# Altium project Vesta_cape.PrjPcb
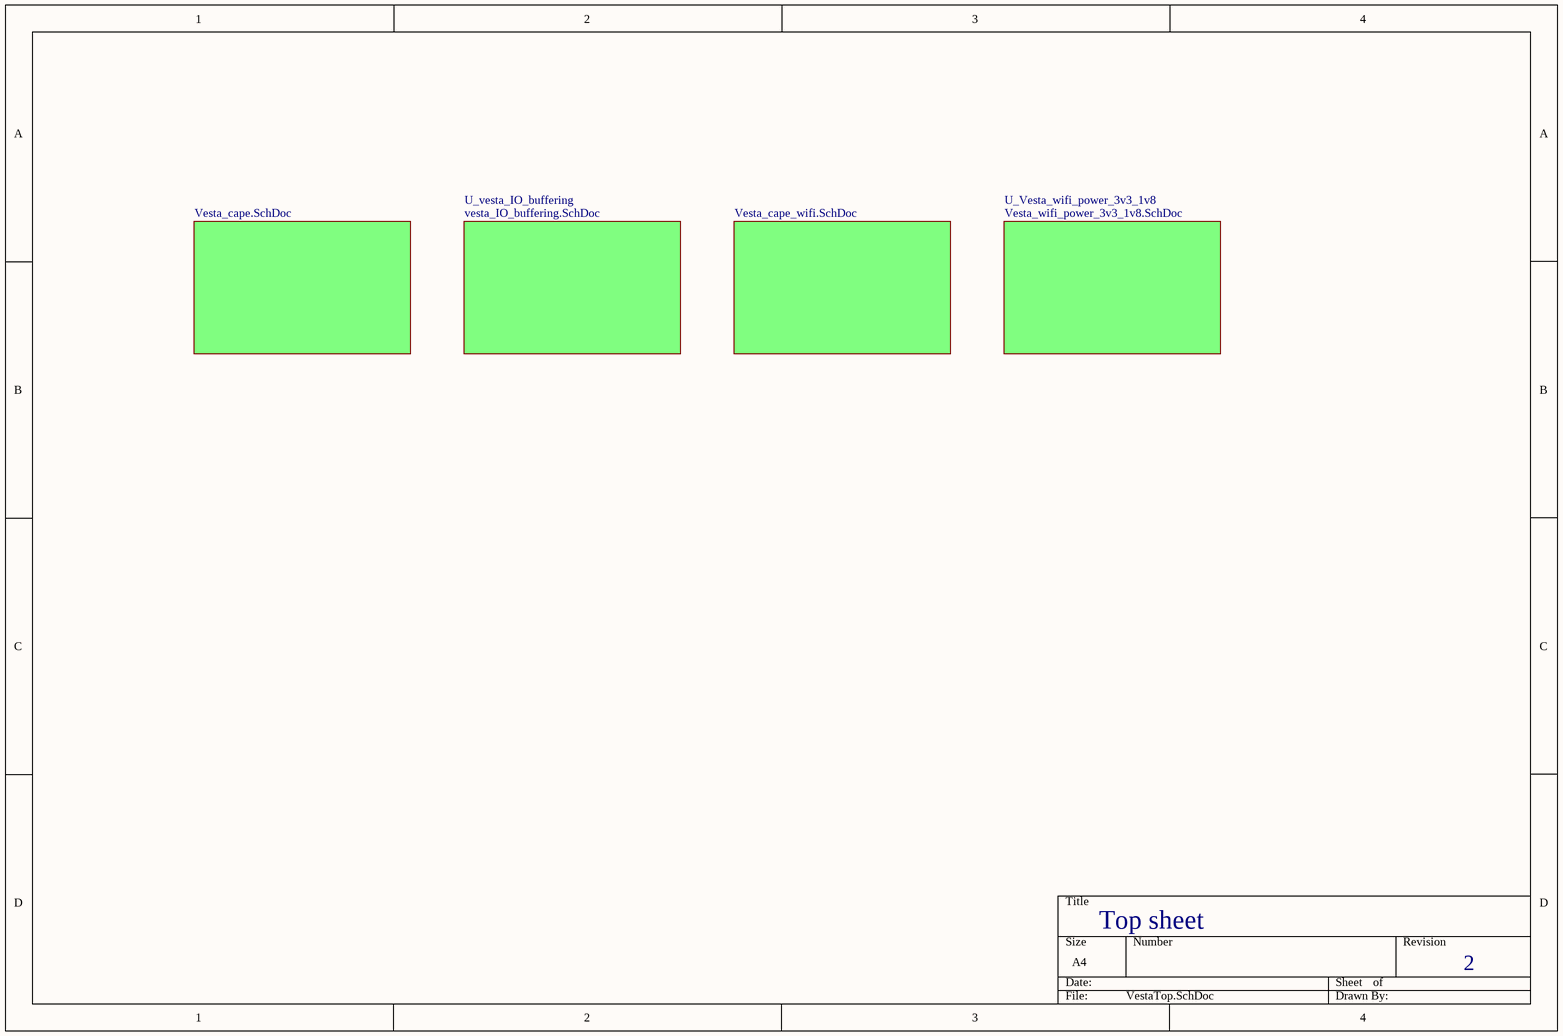
[diagram p0: VestaTop.SchDoc]
5 sheets, 135 parts. Net scope: flat (ports and power ports of the same name join across sheets).
Board file: Vesta_cape.PcbDoc
Sheets:
  VestaTop.SchDoc
    U_Vesta_cape_wifi = Vesta_cape_wifi.SchDoc
    U_Vesta_cape = Vesta_cape.SchDoc
    U_vesta_IO_buffering = vesta_IO_buffering.SchDoc
    U_Vesta_wifi_power_3v3_1v8 = Vesta_wifi_power_3v3_1v8.SchDoc

## Sheet VestaTop.SchDoc
size A4

### Sub-sheets
U_Vesta_cape = Vesta_cape.SchDoc: no entries
U_Vesta_cape_wifi = Vesta_cape_wifi.SchDoc: no entries
U_vesta_IO_buffering = vesta_IO_buffering.SchDoc: no entries
U_Vesta_wifi_power_3v3_1v8 = Vesta_wifi_power_3v3_1v8.SchDoc: no entries

### Notes on the sheet
- Top sheet
- 2

## Sheet Vesta_cape_wifi.SchDoc
size A3
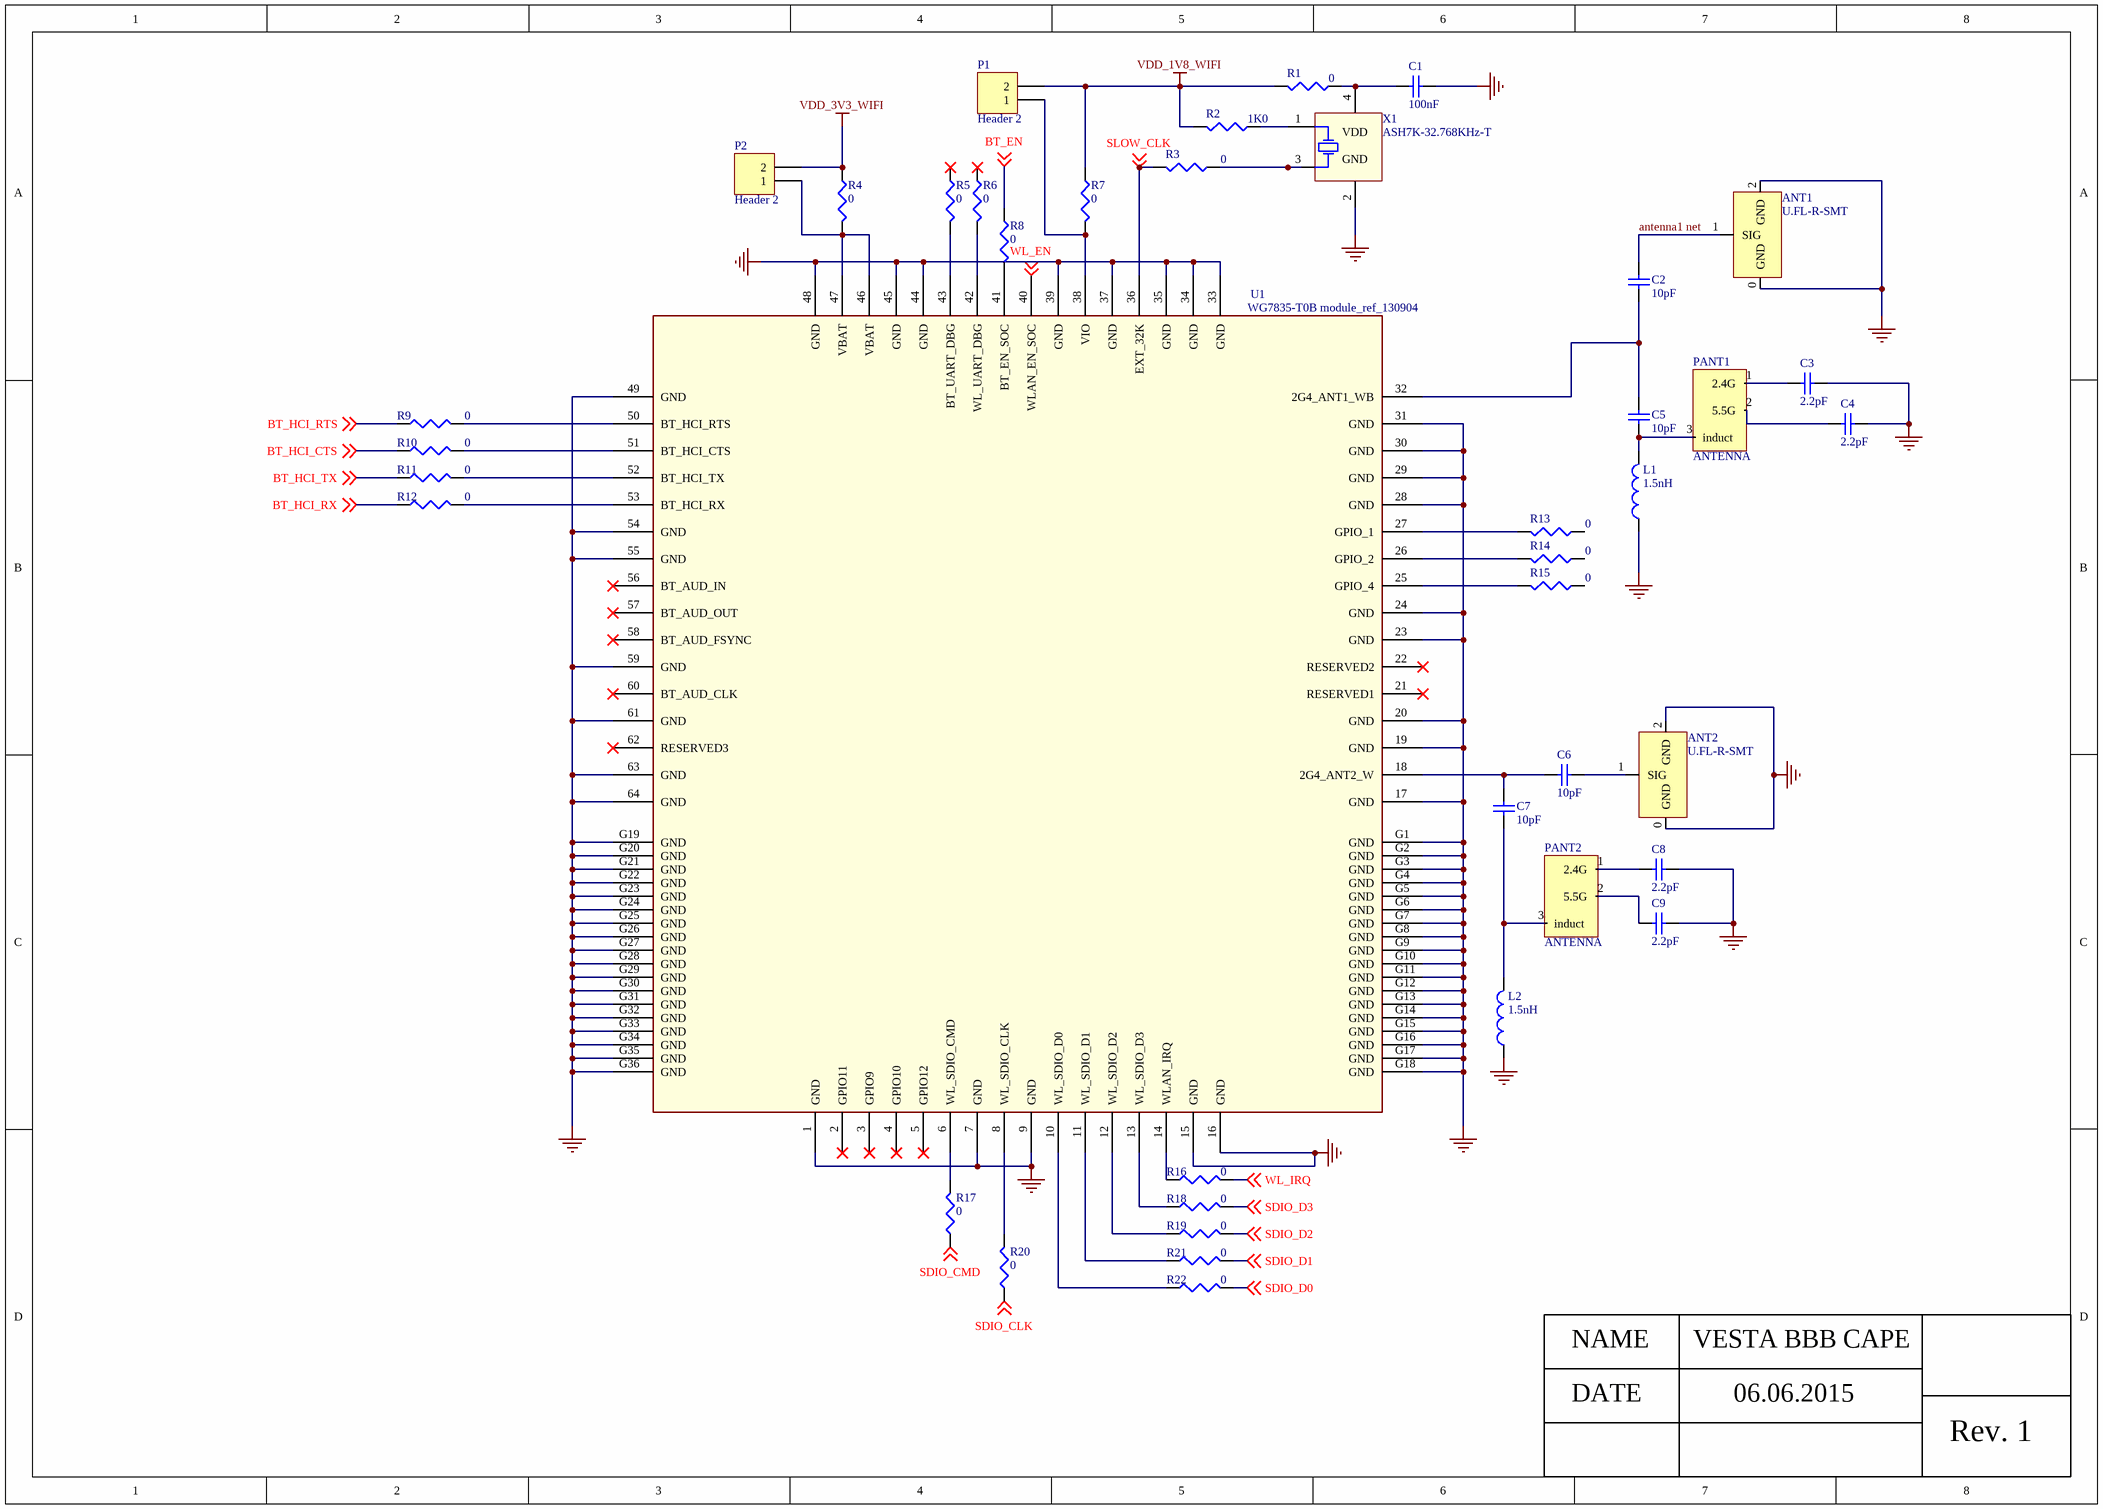
[diagram p1: Vesta_cape_wifi.SchDoc]

### Parts
ANT1  U.FL-R-SMT  [U.FL-R-SMT]
ANT2  U.FL-R-SMT  [U.FL-R-SMT]
C1  100nF  [C1206]
C2  10pF  [Capacitor_0603]
C3  2.2pF  [Capacitor_0603]
C4  2.2pF  [Capacitor_0603]
C5  10pF  [Capacitor_0603]
C6  10pF  [Capacitor_0603]
C7  10pF  [Capacitor_0603]
C8  2.2pF  [Capacitor_0603]
C9  2.2pF  [Capacitor_0603]
L1  1.5nH  [0402-A]
L2  1.5nH  [0402-A]
P1  Header 2  [HDR1X2]
P2  Header 2  [HDR1X2]
PANT1  ANTENNA  [ANT_BRD_CUT]
PANT2  ANTENNA  [ANT_BRD_CUT]
R1  0  [J1-0603]
R2  1K0  [J1-0603]
R3  0  [J1-0603]
R4  0  [J1-0603]
R5  0  [J1-0603]
R6  0  [J1-0603]
R7  0  [J1-0603]
R8  0  [J1-0603]
R9  0  [J1-0603]
R10  0  [J1-0603]
R11  0  [J1-0603]
R12  0  [J1-0603]
R13  0  [J1-0603]
R14  0  [J1-0603]
R15  0  [J1-0603]
R16  0  [J1-0603]
R17  0  [J1-0603]
R18  0  [J1-0603]
R19  0  [J1-0603]
R20  0  [J1-0603]
R21  0  [J1-0603]
R22  0  [J1-0603]
U1  WG7835-T0B module_ref_130904  [E-13.4X13.3-N100_0.75-TOP]
X1  ASH7K-32.768KHz-T  [ABRA-ASH7K-4_V]

### Nets
GND: ANT1.0(GND) ANT1.2(GND) ANT2.0(GND) ANT2.2(GND) C1.1 C3.2 C4.2 C8.2 C9.2 L1.1 L2.1 U1.1(GND) U1.7(GND) U1.9(GND) U1.15(GND) U1.16(GND) U1.17(GND) U1.19(GND) U1.20(GND) U1.23(GND) U1.24(GND) U1.28(GND) U1.29(GND) U1.30(GND) U1.31(GND) U1.33(GND) U1.34(GND) U1.35(GND) U1.37(GND) U1.39(GND) U1.44(GND) U1.45(GND) U1.48(GND) U1.49(GND) U1.54(GND) U1.55(GND) U1.59(GND) U1.61(GND) U1.63(GND) U1.64(GND) U1.G1(GND) U1.G2(GND) U1.G3(GND) U1.G4(GND) U1.G5(GND) U1.G6(GND) U1.G7(GND) U1.G8(GND) U1.G9(GND) U1.G10(GND) U1.G11(GND) U1.G12(GND) U1.G13(GND) U1.G14(GND) U1.G15(GND) U1.G16(GND) U1.G17(GND) U1.G18(GND) U1.G19(GND) U1.G20(GND) U1.G21(GND) U1.G22(GND) U1.G23(GND) U1.G24(GND) U1.G25(GND) U1.G26(GND) U1.G27(GND) U1.G28(GND) U1.G29(GND) U1.G30(GND) U1.G31(GND) U1.G32(GND) U1.G33(GND) U1.G34(GND) U1.G35(GND) U1.G36(GND) X1.2(GND)
VDD_1V8_WIFI: P1.2 R1.2 R2.2 R7.1
VDD_3V3_WIFI: P2.2 R4.1
antenna1 net: ANT1.1(SIG) C2.2
BT_EN: R8.1 ; off-sheet BT_EN
BT_HCI_CTS: R10.1 ; off-sheet BT_HCI_CTS
BT_HCI_RTS: R9.1 ; off-sheet BT_HCI_RTS
BT_HCI_RX: R12.1 ; off-sheet BT_HCI_RX
BT_HCI_TX: R11.1 ; off-sheet BT_HCI_TX
SDIO_CLK: R20.1 ; off-sheet SDIO_CLK
SDIO_CMD: R17.1 ; off-sheet SDIO_CMD
SDIO_D0: R22.2 ; off-sheet SDIO_D0
SDIO_D1: R21.2 ; off-sheet SDIO_D1
SDIO_D2: R19.2 ; off-sheet SDIO_D2
SDIO_D3: R18.2 ; off-sheet SDIO_D3
SLOW_CLK: R3.2 U1.36(EXT_32K) ; off-sheet SLOW_CLK
WL_EN: U1.40(WLAN_EN_SOC) ; off-sheet WL_EN
WL_IRQ: R16.2 ; off-sheet WL_IRQ
NetANT2_1: ANT2.1(SIG) C6.2
NetC1_2: C1.2 R1.1 X1.4(VDD)
NetC2_1: C2.1 C5.2 U1.32(2G4_ANT1_WB)
NetC3_1: C3.1 PANT1.1(2.4G)
NetC4_1: C4.1 PANT1.2(5.5G)
NetC5_1: C5.1 L1.2 PANT1.3(induct)
NetC6_1: C6.1 C7.2 U1.18(2G4_ANT2_W)
NetC7_1: C7.1 L2.2 PANT2.3(induct)
NetC8_1: C8.1 PANT2.1(2.4G)
NetC9_1: C9.1 PANT2.2(5.5G)
NetP1_1: P1.1 R7.2 U1.38(VIO)
NetP2_1: P2.1 R4.2 U1.46(VBAT) U1.47(VBAT)
NetR2_1: R2.1 X1.1(VIO)
NetR3_1: R3.1 X1.3(Output)
NetR5_2: R5.2 U1.43(BT_UART_DBG)
NetR6_2: R6.2 U1.42(WL_UART_DBG)
NetR8_2: R8.2 U1.41(BT_EN_SOC)
NetR9_2: R9.2 U1.50(BT_HCI_RTS)
NetR10_2: R10.2 U1.51(BT_HCI_CTS)
NetR11_2: R11.2 U1.52(BT_HCI_TX)
NetR12_2: R12.2 U1.53(BT_HCI_RX)
NetR13_2: R13.2 U1.27(GPIO_1)
NetR14_2: R14.2 U1.26(GPIO_2)
NetR15_2: R15.2 U1.25(GPIO_4)
NetR16_1: R16.1 U1.14(WLAN_IRQ)
NetR17_2: R17.2 U1.6(WL_SDIO_CMD)
NetR18_1: R18.1 U1.13(WL_SDIO_D3)
NetR19_1: R19.1 U1.12(WL_SDIO_D2)
NetR20_2: R20.2 U1.8(WL_SDIO_CLK)
NetR21_1: R21.1 U1.11(WL_SDIO_D1)
NetR22_1: R22.1 U1.10(WL_SDIO_D0)

Not connected (* = marked no-connect by the designer): R5 1*; R6 1*; R13 1; R14 1; R15 1; U1 2(GPIO11)* 3(GPIO9)* 4(GPIO10)* 5(GPIO12)* 21(RESERVED1)* 22(RESERVED2)* 56(BT_AUD_IN)* 57(BT_AUD_OUT)* 58(BT_AUD_FSYNC)* 60(BT_AUD_CLK)* 62(RESERVED3)*

### Notes on the sheet
- NAME
- VESTA BBB CAPE
- DATE
- 06.06.2015
- Rev. 1

### Library data of the parts
ANT1 ANT2 = U.FL-R-SMT: pin to pad: 0>2
C1 C2 C4-C7 C9 = Cap Semi: Capacitor (Semiconductor SIM Model); Published: 8-Jun-2000; LatestRevisionDate: 29-May-2009; LatestRevisionNote: IPC-7351 Footprint Added.; PackageReference: C1206; Publisher: Altium Limited; PackageDescription: Chip Capacitor
  C1: Value: 100nF
  C2 C5-C7: Value: 10pF
  C4 C9: Value: 2.2pF
C3 C8 = Cap Semi: Capacitor (Semiconductor SIM Model); Value: 100pF; Published: 8-Jun-2000; LatestRevisionDate: 29-May-2009; LatestRevisionNote: IPC-7351 Footprint Added.; PackageReference: C1206; Publisher: Altium Limited; PackageDescription: Chip Capacitor
L1 L2 = Inductor: Code_IEC: 1005; Value: 1.5nHH; Published: 8-Jun-2000; LatestRevisionDate: 29-May-2009; LatestRevisionNote: IPC-7351 Footprint Added.; PackageReference: 0402-A; Publisher: Altium Limited; PackageDescription: Chip Inductor; Code_JEITA: 0402
P1 P2 = Header 2: Header, 2-Pin; LatestRevisionDate: 17-Jul-2002; LatestRevisionNote: Re-released for DXP Platform.; Publisher: Altium Limited
R1-R22 = Res3: Resistor; Value: 1K; Published: 8-Jun-2000; LatestRevisionDate: 29-May-2009; LatestRevisionNote: IPC-7351 Footprint Added.; PackageReference: J1-0603; Publisher: Altium Limited; PackageDescription: Chip Resistor
X1 = CMP-0448-00001-2: Crystal Oscillator, 32.768 kHz, -40 to 80 degC, 3.2 x 1.5 x 1.0 mm SMD, Tape and Reel; Manufacturer: Abracon; Start-up Time (Max): 0.6 s; Vdd Current Consumption (Max): 0.7 uA; Fall Time (Max): 50 ns; Disable Delay Time (Max): 1 us; Supply Voltage Range (VIO): 1.5 to 36 V; Output Load (CMOS): 15 pF; VIO Current Consumption (Max): 3.5 uA; Frequency Tolerance: -18 to 28 ppm; ComponentLink3URL: http://www.abracon.com/Oscillators/ASH7K.pdf; PackageReference: ASH7K-4; ComponentLink1Description: Manufacturer URL; Mounting Technology: Surface Mount; PackageDescription: 4-Pin Hand Drawn, Body 3.2x1.5mm; ComponentLink2URL: http://www.abracon.com/Oscillators/ASH7K.pdf; ComponentLink2Description: Datasheet; PartNumber: ASH7K-32.768KHz-T; ComponentLink1URL: http://www.abracon.com/; Rise Time(Max): 50 ns; DatasheetVersion: 12.27.11; Packing: Tape and Reel; ComponentLink3Description: Package Specification; Supply Voltage Range (Vdd): 1.5 to 36 V; Frequency: 32.768 kHz; Operating Temperature: -40 to 85 degC

## Sheet Vesta_cape.SchDoc: Vesta cape 1
size A3
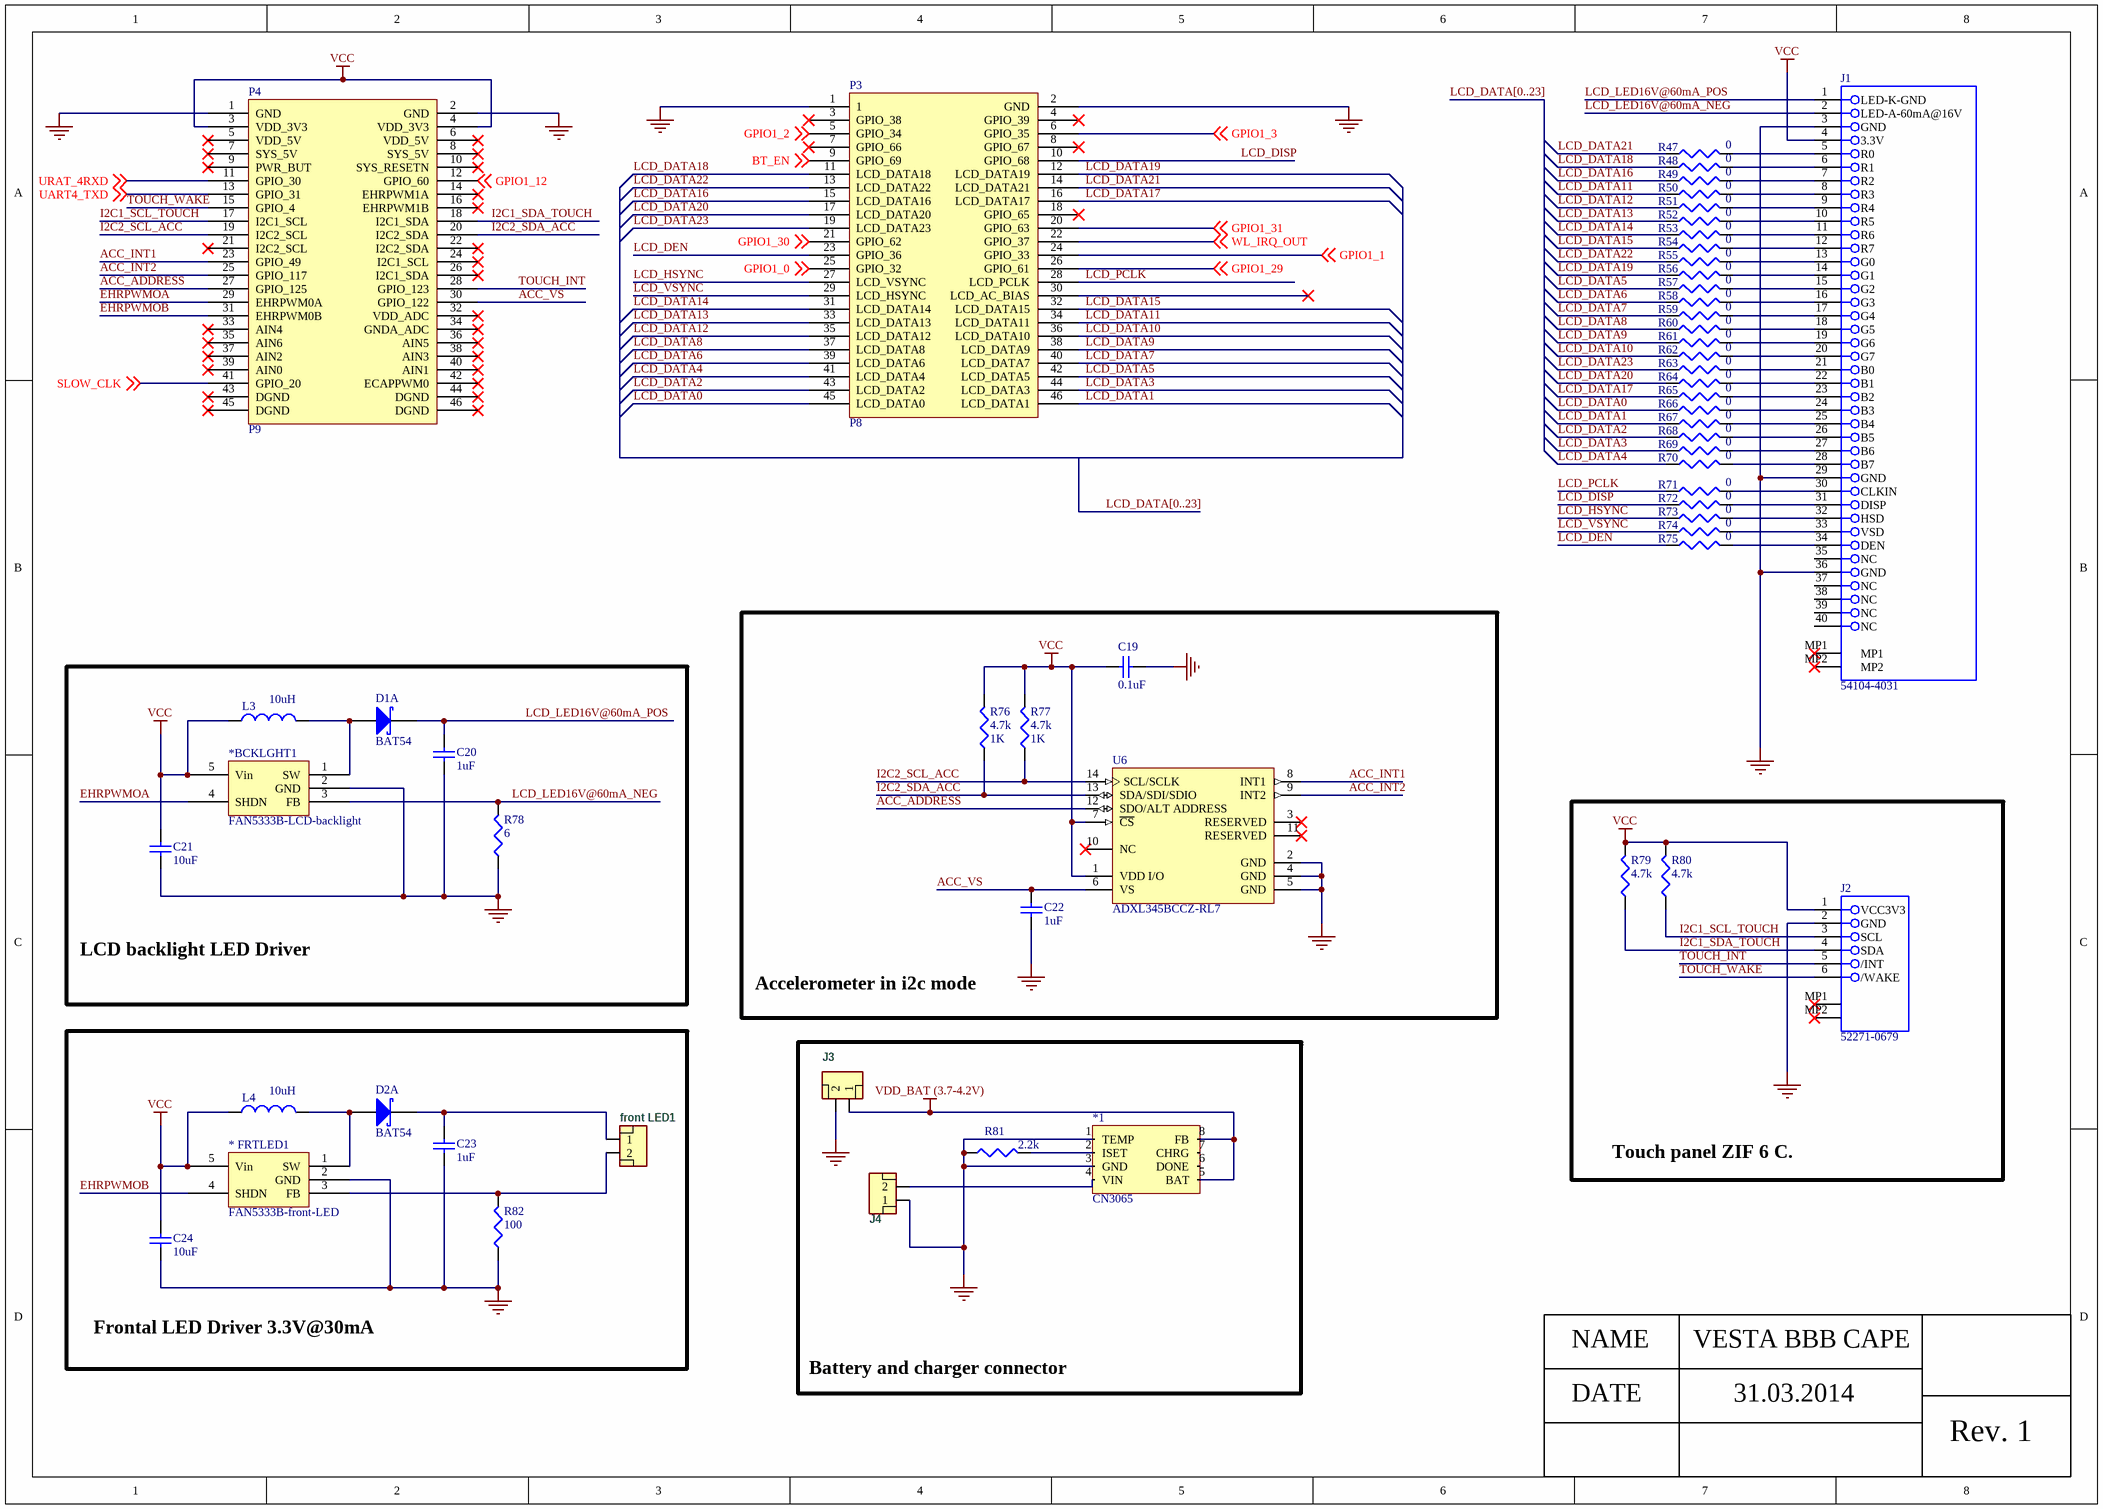
[diagram p2: Vesta_cape.SchDoc]

### Parts
*1  CN3065  [CN3065-LIPO]
*_FRTLED1  FAN5333B-front-LED  [FAN5333A]
*BCKLGHT1  FAN5333B-LCD-backlight  [FAN5333A]
C19  0.1uF  [C1206]
C20  1uF  [C1206]
C21  10uF  [C1206]
C22  1uF  [C1206]
C23  1uF  [C1206]
C24  10uF  [C1206]
D1  BAT54  [NXP-SOT23-3_V]  (part A of 2)
D2  BAT54  [NXP-SOT23-3_V]  (part A of 2)
front_LED1  (no value)  [JMP1X2-F180_2.54]
J1  54104-4031  [MOLX-54104-4031]
J2  52271-0679  [MOLX-52271-0679]
J3  (no value)  [JMP1X2-F180_2.54]
J4  (no value)  [JMP1X2-F180_2.54]
L3  10uH  [0402-A]
L4  10uH  [0402-A]
P3  P8  [HEADER_23_2_SMD]
P4  P9  [HEADER_23_2_SMD]
R47  0  [J1-0603]
R48  0  [J1-0603]
R49  0  [J1-0603]
R50  0  [J1-0603]
R51  0  [J1-0603]
R52  0  [J1-0603]
R53  0  [J1-0603]
R54  0  [J1-0603]
R55  0  [J1-0603]
R56  0  [J1-0603]
R57  0  [J1-0603]
R58  0  [J1-0603]
R59  0  [J1-0603]
R60  0  [J1-0603]
R61  0  [J1-0603]
R62  0  [J1-0603]
R63  0  [J1-0603]
R64  0  [J1-0603]
R65  0  [J1-0603]
R66  0  [J1-0603]
R67  0  [J1-0603]
R68  0  [J1-0603]
R69  0  [J1-0603]
R70  0  [J1-0603]
R71  0  [J1-0603]
R72  0  [J1-0603]
R73  0  [J1-0603]
R74  0  [J1-0603]
R75  0  [J1-0603]
R76  4.7k  value 1K  [J1-0603]
R77  4.7k  value 1K  [J1-0603]
R78  6  [J1-0603]
R79  4.7k  [J1-0603]
R80  4.7k  [J1-0603]
R81  2.2k  [J1-0603]
R82  100  [J1-0603]
U6  ADXL345BCCZ-RL7  [ADI-CC-14-1_V]

### Nets
GND: *1.1(TEMP) *1.3(GND) *_FRTLED1.2(GND) *BCKLGHT1.2(GND) C19.1 C20.1 C21.1 C22.1 C23.1 C24.1 J1.3(GND) J1.29(GND) J1.36(GND) J2.2(GND) J3.2 J4.1 P3.1 P3.2(GND) P4.1(GND) P4.2(GND) R78.1 R81.1 R82.1 U6.2(GND) U6.4(GND) U6.5(GND)
VCC: *_FRTLED1.5(Vin) *BCKLGHT1.5(Vin) C19.2 C21.2 C24.2 J1.4(3.3V) J2.1(VCC3V3) L3.1 L4.1 P4.3(VDD_3V3) P4.4(VDD_3V3) R76.2 R77.2 R79.2 R80.2 U6.1(VDD_I/O) U6.7(~{CS})
VDD_BAT (3.7-4.2V): *1.5(BAT) *1.8(FB) J3.1
ACC_ADDRESS: P4.27(GPIO_125) U6.12(SDO/ALT_ADDRESS)
ACC_INT1: P4.23(GPIO_49) U6.8(INT1)
ACC_INT2: P4.25(GPIO_117) U6.9(INT2)
ACC_VS: C22.2 P4.30(GPIO_122) U6.6(VS)
BT_EN: P3.9(GPIO_69) ; off-sheet BT_EN
EHRPWMOA: *BCKLGHT1.4(SHDN) P4.29(EHRPWM0A)
EHRPWMOB: *_FRTLED1.4(SHDN) P4.31(EHRPWM0B)
GPIO1_0: P3.25(GPIO_32) ; off-sheet GPIO1_0
GPIO1_1: P3.24(GPIO_33) ; off-sheet GPIO1_1
GPIO1_2: P3.5(GPIO_34) ; off-sheet GPIO1_2
GPIO1_3: P3.6(GPIO_35) ; off-sheet GPIO1_3
GPIO1_12: P4.12(GPIO_60) ; off-sheet GPIO1_12
GPIO1_29: P3.26(GPIO_61) ; off-sheet GPIO1_29
GPIO1_30: P3.21(GPIO_62) ; off-sheet GPIO1_30
GPIO1_31: P3.20(GPIO_63) ; off-sheet GPIO1_31
I2C1_SCL_TOUCH: J2.3(SCL) P4.17(I2C1_SCL) R80.1
I2C1_SDA_TOUCH: J2.4(SDA) P4.18(I2C1_SDA) R79.1
I2C2_SCL_ACC: P4.19(I2C2_SCL) R77.1 U6.14(SCL/SCLK)
I2C2_SDA_ACC: P4.20(I2C2_SDA) R76.1 U6.13(SDA/SDI/SDIO)
LCD_DATA0: P3.45(LCD_DATA0) R66.1
LCD_DATA1: P3.46(LCD_DATA1) R67.1
LCD_DATA2: P3.43(LCD_DATA2) R68.1
LCD_DATA3: P3.44(LCD_DATA3) R69.1
LCD_DATA4: P3.41(LCD_DATA4) R70.1
LCD_DATA5: P3.42(LCD_DATA5) R57.1
LCD_DATA6: P3.39(LCD_DATA6) R58.1
LCD_DATA7: P3.40(LCD_DATA7) R59.1
LCD_DATA8: P3.37(LCD_DATA8) R60.1
LCD_DATA9: P3.38(LCD_DATA9) R61.1
LCD_DATA10: P3.36(LCD_DATA10) R62.1
LCD_DATA11: P3.34(LCD_DATA11) R50.1
LCD_DATA12: P3.35(LCD_DATA12) R51.1
LCD_DATA13: P3.33(LCD_DATA13) R52.1
LCD_DATA14: P3.31(LCD_DATA14) R53.1
LCD_DATA15: P3.32(LCD_DATA15) R54.1
LCD_DATA16: P3.15(LCD_DATA16) R49.1
LCD_DATA17: P3.16(LCD_DATA17) R65.1
LCD_DATA18: P3.11(LCD_DATA18) R48.1
LCD_DATA19: P3.12(LCD_DATA19) R56.1
LCD_DATA20: P3.17(LCD_DATA20) R64.1
LCD_DATA21: P3.14(LCD_DATA21) R47.1
LCD_DATA22: P3.13(LCD_DATA22) R55.1
LCD_DATA23: P3.19(LCD_DATA23) R63.1
LCD_DEN: P3.23(GPIO_36) R75.1
LCD_DISP: P3.10(GPIO_68) R72.1
LCD_HSYNC: P3.27(LCD_VSYNC) R73.1
LCD_LED16V@60mA_NEG: *BCKLGHT1.3(FB) J1.2(LED-A-60mA@16V) R78.2
LCD_LED16V@60mA_POS: C20.2 D1.3(K) J1.1(LED-K-GND)
LCD_PCLK: P3.28(LCD_PCLK) R71.1
LCD_VSYNC: P3.29(LCD_HSYNC) R74.1
SLOW_CLK: P4.41(GPIO_20) ; off-sheet SLOW_CLK
TOUCH_INT: J2.5(/INT) P4.28(GPIO_123)
TOUCH_WAKE: J2.6(/WAKE) P4.15(GPIO_4)
UART4_TXD: P4.13(GPIO_31) ; off-sheet UART4_TXD
URAT_4RXD: P4.11(GPIO_30) ; off-sheet URAT_4RXD
WL_IRQ_OUT: P3.22(GPIO_37) ; off-sheet WL_IRQ_OUT
Net*1_2: *1.2(ISET) R81.2
Net*1_4: *1.4(VIN) J4.2
Net*_FRTLED1_1: *_FRTLED1.1(SW) D2.1(A) L4.2
Net*_FRTLED1_3: *_FRTLED1.3(FB) front_LED1.2 R82.2
Net*BCKLGHT1_1: *BCKLGHT1.1(SW) D1.1(A) L3.2
NetC23_2: C23.2 D2.3(K) front_LED1.1
NetJ1_5: J1.5(R0) R47.2
NetJ1_6: J1.6(R1) R48.2
NetJ1_7: J1.7(R2) R49.2
NetJ1_8: J1.8(R3) R50.2
NetJ1_9: J1.9(R4) R51.2
NetJ1_10: J1.10(R5) R52.2
NetJ1_11: J1.11(R6) R53.2
NetJ1_12: J1.12(R7) R54.2
NetJ1_13: J1.13(G0) R55.2
NetJ1_14: J1.14(G1) R56.2
NetJ1_15: J1.15(G2) R57.2
NetJ1_16: J1.16(G3) R58.2
NetJ1_17: J1.17(G4) R59.2
NetJ1_18: J1.18(G5) R60.2
NetJ1_19: J1.19(G6) R61.2
NetJ1_20: J1.20(G7) R62.2
NetJ1_21: J1.21(B0) R63.2
NetJ1_22: J1.22(B1) R64.2
NetJ1_23: J1.23(B2) R65.2
NetJ1_24: J1.24(B3) R66.2
NetJ1_25: J1.25(B4) R67.2
NetJ1_26: J1.26(B5) R68.2
NetJ1_27: J1.27(B6) R69.2
NetJ1_28: J1.28(B7) R70.2
NetJ1_30: J1.30(CLKIN) R71.2
NetJ1_31: J1.31(DISP) R72.2
NetJ1_32: J1.32(HSD) R73.2
NetJ1_33: J1.33(VSD) R74.2
NetJ1_34: J1.34(DEN) R75.2

Not connected (* = marked no-connect by the designer): *1 6(DONE) 7(CHRG); J1 35(NC) 37(NC) 38(NC) 39(NC) 40(NC) MP1* MP2*; J2 MP1* MP2*; P3 3(GPIO_38)* 4(GPIO_39)* 7(GPIO_66)* 8(GPIO_67)* 18(GPIO_65)* 30(LCD_AC_BIAS)*; P4 5(VDD_5V)* 6(VDD_5V)* 7(SYS_5V)* 8(SYS_5V)* 9(PWR_BUT)* 10(SYS_RESETN)* 14(EHRPWM1A)* 16(EHRPWM1B)* 21(I2C2_SCL)* 22(I2C2_SDA)* 24(I2C1_SCL)* 26(I2C1_SDA)* 32(VDD_ADC)* 33(AIN4)* 34(GNDA_ADC)* 35(AIN6)* 36(AIN5)* 37(AIN2)* 38(AIN3)* 39(AIN0)* 40(AIN1)* 42(ECAPPWM0)* 43(DGND)* 44(DGND)* 45(DGND)* 46(DGND)*; U6 3(RESERVED)* 10(NC)* 11(RESERVED)*

### Buses and harness runs
bus LCD_DATA[0..23]

### Notes on the sheet
- LCD backlight LED Driver 16V@60mA
- Accelerometer in i2c mode
- Touch panel ZIF 6 C.
- Frontal LED Driver 3.3V@30mA
- Battery and charger connector
- NAME
- VESTA BBB CAPE
- DATE
- 31.03.2014
- Rev. 1

### Library data of the parts
*_FRTLED1 *BCKLGHT1 = FAN5333B
C19 = Cap Semi: as C3 on sheet Vesta_cape_wifi; Published: 8-Jun-2000; LatestRevisionDate: 29-May-2009; LatestRevisionNote: IPC-7351 Footprint Added.; PackageReference: C1206; Publisher: Altium Limited; PackageDescription: Chip Capacitor
C20 C22 C23 = Cap Semi: Capacitor (Semiconductor SIM Model); Published: 8-Jun-2000; LatestRevisionDate: 29-May-2009; LatestRevisionNote: IPC-7351 Footprint Added.; PackageReference: C1206; Publisher: Altium Limited; PackageDescription: Chip Capacitor; Value: 1uF
C21 C24 = Cap Semi: Capacitor (Semiconductor SIM Model); Value: 100uF; Published: 8-Jun-2000; LatestRevisionDate: 29-May-2009; LatestRevisionNote: IPC-7351 Footprint Added.; PackageReference: C1206; Publisher: Altium Limited; PackageDescription: Chip Capacitor
D1 D2 = CMP-0417-00004-1: Schottky Barrier Diode, 30 V, 2 uA, -55 to 150 degC, 3-Pin SOT23, RoHS, Tape and Reel; Manufacturer: NXP Semiconductors; Cd (pF): 10; Rth(j-a) (K/W): 500; VF (mV): 800; Trr (ns): 5; IR (uA): 2; VR (V): 30; Mounting Technology: Surface Mount; Temperature Range: -55 to 150 degC; Packing: Tape and Reel; PartNumber: BAT54; ComponentLink2Description: Datasheet; PackageReference: SOT23-3; ComponentLink2URL: http://www.nxp.com/documents/data_sheet/BAT54_SER.pdf; RoHS: TRUE; ComponentLink1Description: Manufacturer URL; PackageDescription: 3-Pin Plastic Surface-mounted Package, Body 1.3 x 2.9 mm, Pitch 0.95 mm; ComponentLink1URL: http://www.nxp.com/; PartId: 1
  D2: DatasheetVersion: Rev. 5
front_LED1 = JST-2: =Description
J1 = MOLX-54104-4031: 0.5 mm Pitch Easy-On(TM) Type FPC Connector, 2.0 mm Mated Height, Right Angle, ZIF, SMT, Top Contact, 40 Circuits, -20 to 85 degC, ELV and RoHS Compliant, Tape and Reel; pin to pad: 1>40 2>39 3>38 4>37 5>36 6>35 7>34 8>33 9>32 10>31 11>30 12>29 13>28 14>27 15>26 16>25 17>24 18>23 19>22 20>21 21>20 22>19 23>18 24>17 25>16 26>15 27>14 28>13 29>12 30>11 31>10 32>9 33>8 34>7 35>6 36>5 37>4 38>3 39>2 40>1; Manufacturer: Molex; PCB Retention: Yes; Current (Max per Contact): 0.5A; Stackable: No; Durability (mating cycles max): 20; Pitch - Mating Interface: 0.50mm; Circuits (Loaded): 40; Mated Height: 2.00mm; Entry Angle: 90degrees Angle; Material - Metal: Phosphor Bronze; Voltage (Max): 50V; ComponentLink3URL: http://www.molex.com/pdm_docs/sd/541044031_sd.pdf; ComponentLink2URL: http://www.molex.com/webdocs/datasheets/pdf/en-us/0541044031_FFC_FPC_CONNECTORS.pdf; Number of Rows: 1; ComponentLink1Description: Manufacturer URL; ComponentLink2Description: Datasheet; Mounting Technology: Surface Mount; ComponentLink1URL: http://www.molex.com/molex/index.jsp; RoHS: TRUE; PackageReference: 54104-4031; Polarized to PCB: Yes; ComponentLink3Description: Package Specification; PackageVersion: Rev. F, 06/2012; PackageDescription: 40-Lead FPC Connector, Pitch 0.5 mm; Contact Position: Top; PCB Locator: No; PartNumber: 54104-4031; Orientation: Right Angle; Packing: Tape and Reel
J2 = MOLX-52271-0679: 1.0 mm Pitch Easy-On(TM) Type FPC Connector, 3.0 mm Mated Height, Right Angle, ZIF, SMT, Bottom Contact, 6 Circuits, -40 to 85 degC, ELV and RoHS Compliant, Tape and Reel; Manufacturer: Molex; Material - Plating Termination: Tin-Bismuth; Pitch - Mating Interface: 1.00mm; Voltage (Max): 50V AC (RMS)/DC; Durability (mating cycles max): 30; Mated Height: 3.00mm; PCB Locator: No; Polarized to PCB: Yes; Material - Metal: Phosphor Bronze; Current (Max per Contact): 0.5A; Circuits (Loaded): 6; Entry Angle: 90degrees Angle; ComponentLink1Description: Manufacturer URL; PackageVersion: Rev. B, 04/2004; PackageDescription: 6-Lead FPC Connector, Pitch 1.0 mm; Packing: Tape and Reel; Contact Position: Bottom; Material - Plating Mating: Tin-Bismuth; PackageReference: 52271-0679; RoHS: TRUE; ComponentLink2Description: Datasheet; ComponentLink1URL: http://www.molex.com/molex/index.jsp; PartNumber: 52271-0679; Pitch - Termination Interface: 1.00mm; ComponentLink3URL: http://www.molex.com/pdm_docs/sd/522710679_sd.pdf; Orientation: Right Angle; Number of Rows: 1; Stackable: No; PCB Retention: Yes; Mounting Technology: Surface Mount; ComponentLink3Description: Package Specification; ComponentLink2URL: http://www.molex.com/webdocs/datasheets/pdf/en-us/0522710679_FFC_FPC_CONNECTORS.pdf
J3 = JST-2: jst2mm connector
J4 = JST-2: jst 2mm connector
L3 L4 = Inductor: Code_IEC: 1005; Value: 10mH; Published: 8-Jun-2000; LatestRevisionDate: 29-May-2009; LatestRevisionNote: IPC-7351 Footprint Added.; PackageReference: 0402-A; Publisher: Altium Limited; PackageDescription: Chip Inductor; Code_JEITA: 0402
P3 = HDR_2_23_M_P8: BBB-P8
P4 = HDR2-23-M-P9: BBB-P9
R47-R75 = Res3: Resistor; Value: 0K; Published: 8-Jun-2000; LatestRevisionDate: 29-May-2009; LatestRevisionNote: IPC-7351 Footprint Added.; PackageReference: J1-0603; Publisher: Altium Limited; PackageDescription: Chip Resistor
R76 R77 R79 R80 R82 = Res3: Resistor; Published: 8-Jun-2000; LatestRevisionDate: 29-May-2009; LatestRevisionNote: IPC-7351 Footprint Added.; PackageReference: J1-0603; Publisher: Altium Limited; PackageDescription: Chip Resistor
  R79 R80: Value: 4.7k
  R82: Value: 100
R78 = Res3: Resistor; Value: 1K; Published: 8-Jun-2000; LatestRevisionDate: 29-May-2009; LatestRevisionNote: IPC-7351 Footprint Added.; PackageReference: J1-0603; Publisher: Altium Limited; PackageDescription: Chip Resistor
R81 = Res3: Resistor; Value: 2K; Published: 8-Jun-2000; LatestRevisionDate: 29-May-2009; LatestRevisionNote: IPC-7351 Footprint Added.; PackageReference: J1-0603; Publisher: Altium Limited; PackageDescription: Chip Resistor
U6 = CMP-0885-00033-1: 3-Axis, +/-2 g / +/-4 g / +/-8 g / +/-16 g Digital Accelerometer with Digital Output, 1.6 KHz BW, Industrial, 14-pin LGA, Reel; Manufacturer: Analog Devices; Supply Current: 140 uA; Voltage Supply (V): 2.0 to 3.6; -3dB Bandwidth: 1.6 KHz; Sensitivity: 256/128/64/32 LSB/g; # of Axes: 3; Output Type: Digital; PackageDescription: 14-Pin Land Grid Array, 3 x 5 mm Body, 0.8 mm Pitch; ComponentLink1URL: http://www.analog.com/en/index.html; ComponentLink2Description: Datasheet; PartNumber: ADXL345BCCZ-RL7; ComponentLink3Description: Package Specification; ComponentLink4URL: http://www.analog.com/en/mems-sensors/mems-inertial-sensors/adxl345/products/product.html; PackageVersion: 03-16-2010-A, 03/2010; ComponentLink1Description: Manufacturer URL; ComponentLink2URL: http://www.analog.com/static/imported-files/data_sheets/ADXL345.pdf; DatasheetVersion: Rev. D; PackageReference: CC-14-1; Packing: Reel; Mounting Technology: Surface Mount; ComponentLink4Description: Product URL; ComponentLink3URL: http://www.analog.com/static/imported-files/data_sheets/ADXL343.pdf

## Sheet vesta_IO_buffering.SchDoc
size A3
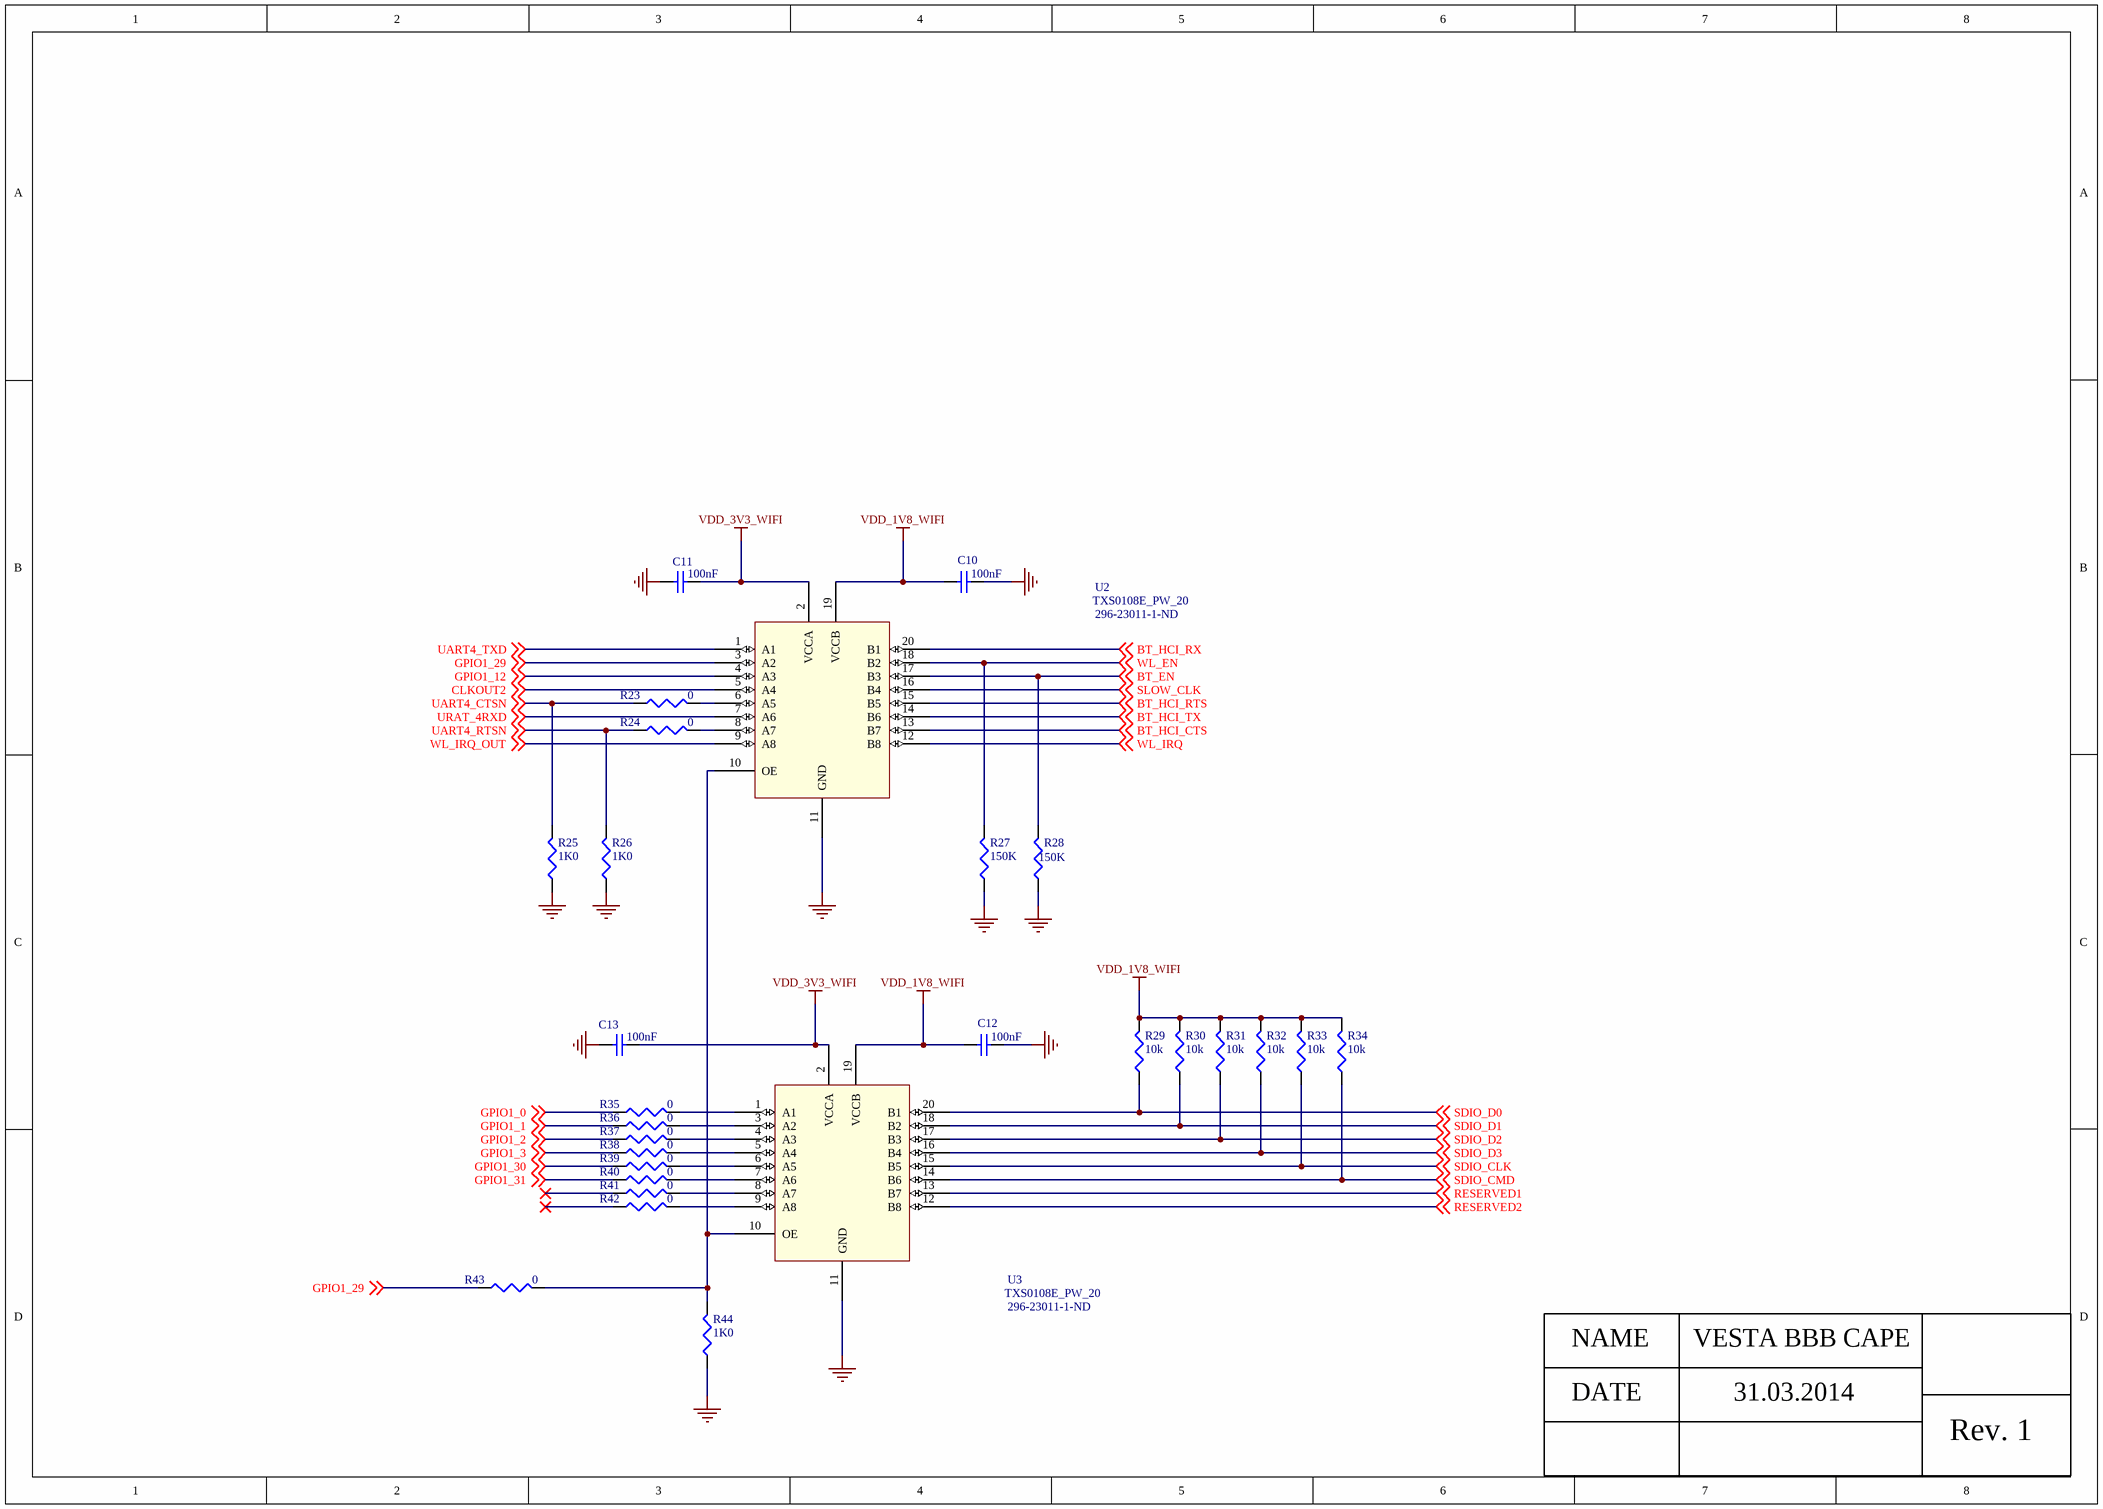
[diagram p3: vesta_IO_buffering.SchDoc]

### Parts
C10  value 100nF  [C2512]  (hidden comment: Cap Semi)
C11  value 100nF  [C2512]  (hidden comment: Cap Semi)
C12  100nF  [C2512]
C13  100nF  [C2512]
R23  0  [J1-0603]
R24  0  [J1-0603]
R25  1K0  [J1-0603]
R26  1K0  [J1-0603]
R27  150K  [J1-0603]
R28  150K  [J1-0603]
R29  10k  [J1-0603]
R30  10k  [J1-0603]
R31  10k  [J1-0603]
R32  10k  [J1-0603]
R33  10k  [J1-0603]
R34  10k  [J1-0603]
R35  0  [J1-0603]
R36  0  [J1-0603]
R37  0  [J1-0603]
R38  0  [J1-0603]
R39  0  [J1-0603]
R40  0  [J1-0603]
R41  0  [J1-0603]
R42  0  [J1-0603]
R43  0  [J1-0603]
R44  1K0  [J1-0603]
U2  TXS0108E_PW_20  Supplier Part Number 1: 296-23011-1-ND  [PW20]
U3  TXS0108E_PW_20  Supplier Part Number 1: 296-23011-1-ND  [PW20]

### Nets
GND: C10.2 C11.1 C12.2 C13.1 R25.1 R26.1 R27.1 R28.1 R44.1 U2.11(GND) U3.11(GND)
VDD_1V8_WIFI: C10.1 C12.1 R29.2 R30.2 R31.2 R32.2 R33.2 R34.2 U2.19(VCCB) U3.19(VCCB)
VDD_3V3_WIFI: C11.2 C13.2 U2.2(VCCA) U3.2(VCCA)
BT_EN: R28.2 U2.17(B3) ; off-sheet BT_EN
BT_HCI_CTS: U2.13(B7) ; off-sheet BT_HCI_CTS
BT_HCI_RTS: U2.15(B5) ; off-sheet BT_HCI_RTS
BT_HCI_RX: U2.20(B1) ; off-sheet BT_HCI_RX
BT_HCI_TX: U2.14(B6) ; off-sheet BT_HCI_TX
CLKOUT2: U2.5(A4) ; off-sheet CLKOUT2
GPIO1_0: R35.1 ; off-sheet GPIO1_0
GPIO1_1: R36.1 ; off-sheet GPIO1_1
GPIO1_2: R37.1 ; off-sheet GPIO1_2
GPIO1_3: R38.1 ; off-sheet GPIO1_3
GPIO1_12: U2.4(A3) ; off-sheet GPIO1_12
GPIO1_29: R43.1 U2.3(A2) ; off-sheet GPIO1_29
GPIO1_30: R39.1 ; off-sheet GPIO1_30
GPIO1_31: R40.1 ; off-sheet GPIO1_31
RESERVED1: U3.13(B7) ; off-sheet RESERVED1
RESERVED2: U3.12(B8) ; off-sheet RESERVED2
SDIO_CLK: R33.1 U3.15(B5) ; off-sheet SDIO_CLK
SDIO_CMD: R34.1 U3.14(B6) ; off-sheet SDIO_CMD
SDIO_D0: R29.1 U3.20(B1) ; off-sheet SDIO_D0
SDIO_D1: R30.1 U3.18(B2) ; off-sheet SDIO_D1
SDIO_D2: R31.1 U3.17(B3) ; off-sheet SDIO_D2
SDIO_D3: R32.1 U3.16(B4) ; off-sheet SDIO_D3
SLOW_CLK: U2.16(B4) ; off-sheet SLOW_CLK
UART4_CTSN: R23.1 R25.2 ; off-sheet UART4_CTSN
UART4_RTSN: R24.1 R26.2 ; off-sheet UART4_RTSN
UART4_TXD: U2.1(A1) ; off-sheet UART4_TXD
URAT_4RXD: U2.7(A6) ; off-sheet URAT_4RXD
WL_EN: R27.2 U2.18(B2) ; off-sheet WL_EN
WL_IRQ: U2.12(B8) ; off-sheet WL_IRQ
WL_IRQ_OUT: U2.9(A8) ; off-sheet WL_IRQ_OUT
NetR23_2: R23.2 U2.6(A5)
NetR24_2: R24.2 U2.8(A7)
NetR35_2: R35.2 U3.1(A1)
NetR36_2: R36.2 U3.3(A2)
NetR37_2: R37.2 U3.4(A3)
NetR38_2: R38.2 U3.5(A4)
NetR39_2: R39.2 U3.6(A5)
NetR40_2: R40.2 U3.7(A6)
NetR41_2: R41.2 U3.8(A7)
NetR42_2: R42.2 U3.9(A8)
NetR43_2: R43.2 R44.2 U2.10(OE) U3.10(OE)

Not connected (* = marked no-connect by the designer): R41 1*; R42 1*

### Notes on the sheet
- NAME
- VESTA BBB CAPE
- DATE
- 31.03.2014
- Rev. 1

### Library data of the parts
C10-C13 = Cap Semi: Capacitor (Semiconductor SIM Model); Published: 8-Jun-2000; LatestRevisionDate: 29-May-2009; LatestRevisionNote: IPC-7351 Footprint Added.; PackageReference: C1206; Publisher: Altium Limited; PackageDescription: Chip Capacitor
  C12 C13: Value: 100nF
R23-R28 R35-R44 = Res3: Resistor; Value: 1K; Published: 8-Jun-2000; LatestRevisionDate: 29-May-2009; LatestRevisionNote: IPC-7351 Footprint Added.; PackageReference: J1-0603; Publisher: Altium Limited; PackageDescription: Chip Resistor
R29-R34 = Res3: Resistor; Published: 8-Jun-2000; LatestRevisionDate: 29-May-2009; LatestRevisionNote: IPC-7351 Footprint Added.; PackageReference: J1-0603; Publisher: Altium Limited; PackageDescription: Chip Resistor; Value: 10K
U2 U3 = TXS0108E_PW_20: Imported; Vendor: Texas Instruments; PACKAGE_DESIGNATOR: PW; PIN_COUNT: 20; FAMILY_NAME: AUTO DIRECTION SENSING DUAL SUPPLY TRANSLATOR; INDUSTRY_STD_PKG_TYPE: TSSOP; Manufacturer_Part_Number: txs0108e_pw_20; GENERIC_PART_NUMBER: TXS0108E; Datasheet URL: http://www.ti.com/lit/gpn/TXB0108; Manufacturer: Texas Instruments; RefDes: RefDes; Type: DEV; Value: Value; Supplier 1: Digi-Key

## Sheet Vesta_wifi_power_3v3_1v8.SchDoc
size A4
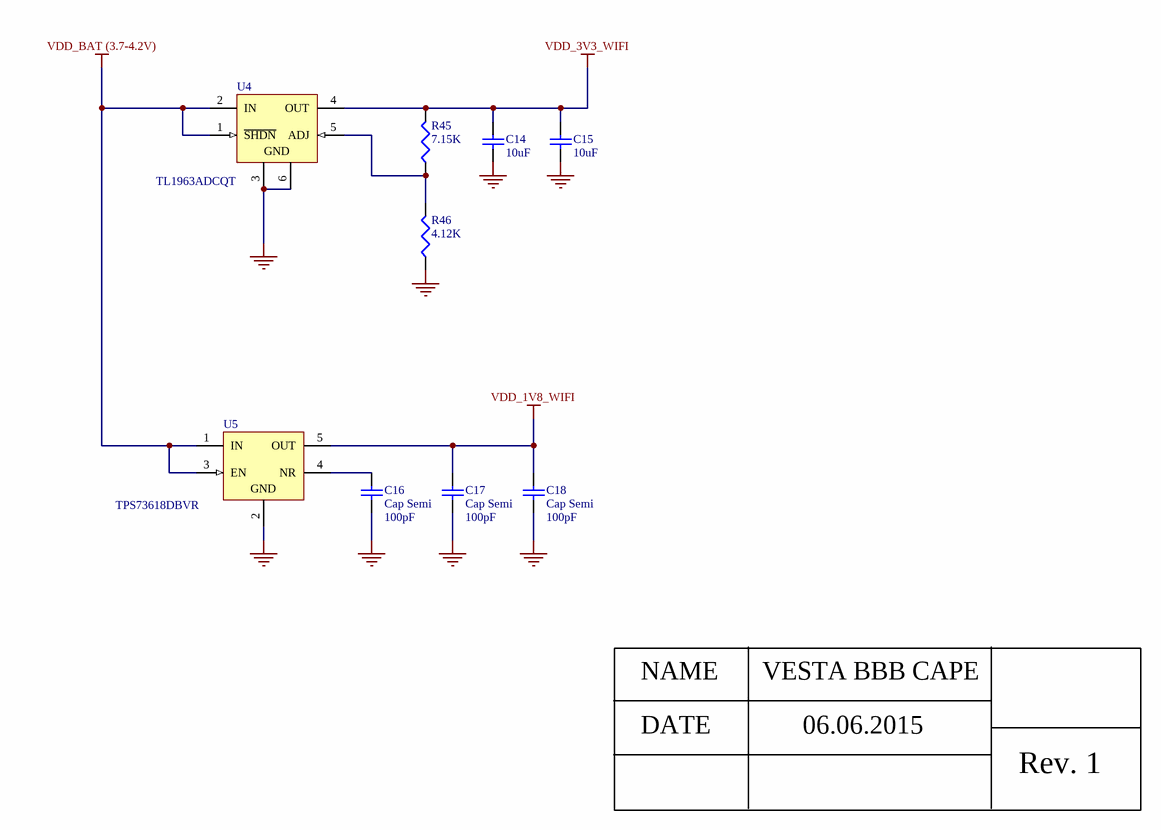
[diagram p4: Vesta_wifi_power_3v3_1v8.SchDoc]

### Parts
C14  10uF  [C1206]
C15  10uF  [C1206]
C16  Cap Semi  value 100pF  [C1206]
C17  Cap Semi  value 100pF  [C1206]
C18  Cap Semi  value 100pF  [C1206]
R45  7.15K  [J1-0603]
R46  4.12K  [J1-0603]
U4  TL1963ADCQT  [TI-DCQ6_M]
U5  TPS73618DBVR  [TI-DBV5_N]

### Nets
GND: C14.1 C15.1 C16.1 C17.1 C18.1 R46.1 U4.3(GND) U4.6(GND) U5.2(GND)
VDD_1V8_WIFI: C17.2 C18.2 U5.5(OUT)
VDD_3V3_WIFI: C14.2 C15.2 R45.2 U4.4(OUT)
VDD_BAT (3.7-4.2V): U4.1(~{SHDN}) U4.2(IN) U5.1(IN) U5.3(EN)
NetC16_2: C16.2 U5.4(NR)
NetR45_1: R45.1 R46.2 U4.5(ADJ)

### Notes on the sheet
- NAME
- VESTA BBB CAPE
- DATE
- 06.06.2015
- Rev. 1

### Library data of the parts
C14 C15 = Cap Semi: as C3 on sheet Vesta_cape_wifi; Published: 8-Jun-2000; LatestRevisionDate: 29-May-2009; LatestRevisionNote: IPC-7351 Footprint Added.; PackageReference: C1206; Publisher: Altium Limited; PackageDescription: Chip Capacitor
C16-C18 = Cap Semi: Capacitor (Semiconductor SIM Model); Published: 8-Jun-2000; LatestRevisionDate: 29-May-2009; LatestRevisionNote: IPC-7351 Footprint Added.; PackageReference: C1206; Publisher: Altium Limited; PackageDescription: Chip Capacitor
R45 = Res3: Resistor; Value: 7.15; Published: 8-Jun-2000; LatestRevisionDate: 29-May-2009; LatestRevisionNote: IPC-7351 Footprint Added.; PackageReference: J1-0603; Publisher: Altium Limited; PackageDescription: Chip Resistor
R46 = Res3: Resistor; Value: 1K; Published: 8-Jun-2000; LatestRevisionDate: 29-May-2009; LatestRevisionNote: IPC-7351 Footprint Added.; PackageReference: J1-0603; Publisher: Altium Limited; PackageDescription: Chip Resistor
U4 = CMP-0395-00365-1: Single Output Fast Transient Response LDO, 1.5 A, Adjustable 1.21 to 20 V Output, 2.1 to 20 V Input, 6-pin SOT-223 (DCQ), -40 to 125 degC, Green (RoHS & no Sb/Br); Manufacturer: Texas Instruments; Vin(Min)(V): 2.1; Iq(Typ)(mA): 1; Vdo(Typ)(mV): 340; Vout Adj(Max)(V): 20; Iout(Max)(A): 1.5; Vout Adj(Min)(V): 1.21; SubFamily: Single Channel LDO; PackageDescription: 6-Pin Plastic Small Outline, Body 3.5 x 6.5 mm, Pitch 1.27 mm; ComponentLink3URL: http://www.ti.com/litv/pdf/mpds098c; ComponentLink2Description: Datasheet; Eco-Plan: Green (RoHS & no Sb/Br); PackageReference: DCQ6; ComponentLink1URL: http://www.ti.com/; PartNumber: TL1963ADCQT; ComponentLink3Description: Package Specification; PackageVersion: 4202109/D; DatasheetVersion: SLVS719F; ComponentLink2URL: http://www.ti.com/general/docs/lit/getliterature.tsp?genericPartNumber=TL1963A&fileType=pdf; ComponentLink1Description: Manufacturer URL; Mounting Technology: Surface Mount; Vin(Max)(V): 20
U5 = CMP-0395-00289-1: Single Output Low Noise LDO, 400 mA, Fixed 1.8 V Output, 1.7 to 5.5 V Input, with Reverse Current Protection, 5-pin SOT-23 (DBV), -40 to 85 degC, Green (RoHS & no Sb/Br); Manufacturer: Texas Instruments; Fixed Output Options(V): 1.8; Vin(Min)(V): 1.7; Accuracy(%): 1; Vin(Max)(V): 5.5; Rating: Catalog; Iq(Typ)(mA): 0.3; Iout(Max)(A): 0.4; Vdo(Typ)(mV): 75; SubFamily: Single Channel LDO; PackageVersion: 4073253-4/K; ComponentLink4Description: URL Link1; ComponentLink2URL: http://www.ti.com/general/docs/lit/getliterature.tsp?genericPartNumber=TPS73618&fileType=pdf; ComponentLink2Description: Datasheet; Vout Adj(Min)(V): 1.8; ComponentLink3URL: http://www.ti.com/litv/pdf/mpds018i; ComponentLink1URL: http://www.ti.com/; Code_JEDEC: MO-178; Vout Adj(Max)(V): 1.8; ComponentLink3Description: Package Specification; DatasheetVersion: SBVS038T; PartNumber: TPS73618DBVR; PackageReference: DBV5; Eco-Plan: Green (RoHS & no Sb/Br); Mounting Technology: Surface Mount; PackageDescription: 5-Pin Plastic Small Outline, Body 1.60 Ã— 2.90 mm, Pitch 0.95 mm; ComponentLink4URL: Samples URL:http://www.ti.com/product/tps73618#samples; ComponentLink1Description: Manufacturer URL

## Nets that join several sheets
GND: Vesta_cape_wifi (77 pins), Vesta_cape (26 pins), vesta_IO_buffering (11 pins), Vesta_wifi_power_3v3_1v8 (9 pins)
VDD_1V8_WIFI: Vesta_cape_wifi (P1.2 R1.2 R2.2 R7.1), vesta_IO_buffering (10 pins), Vesta_wifi_power_3v3_1v8 (C17.2 C18.2 U5.5)
VDD_3V3_WIFI: Vesta_cape_wifi (P2.2 R4.1), vesta_IO_buffering (C11.2 C13.2 U2.2 U3.2), Vesta_wifi_power_3v3_1v8 (C14.2 C15.2 R45.2 U4.4)
VDD_BAT (3.7-4.2V): Vesta_cape (*1.5 *1.8 J3.1), Vesta_wifi_power_3v3_1v8 (U4.1 U4.2 U5.1 U5.3)
BT_EN: Vesta_cape_wifi (R8.1), Vesta_cape (P3.9), vesta_IO_buffering (R28.2 U2.17)
BT_HCI_CTS: Vesta_cape_wifi (R10.1), vesta_IO_buffering (U2.13)
BT_HCI_RTS: Vesta_cape_wifi (R9.1), vesta_IO_buffering (U2.15)
BT_HCI_RX: Vesta_cape_wifi (R12.1), vesta_IO_buffering (U2.20)
BT_HCI_TX: Vesta_cape_wifi (R11.1), vesta_IO_buffering (U2.14)
GPIO1_0: Vesta_cape (P3.25), vesta_IO_buffering (R35.1)
GPIO1_1: Vesta_cape (P3.24), vesta_IO_buffering (R36.1)
GPIO1_2: Vesta_cape (P3.5), vesta_IO_buffering (R37.1)
GPIO1_3: Vesta_cape (P3.6), vesta_IO_buffering (R38.1)
GPIO1_12: Vesta_cape (P4.12), vesta_IO_buffering (U2.4)
GPIO1_29: Vesta_cape (P3.26), vesta_IO_buffering (R43.1 U2.3)
GPIO1_30: Vesta_cape (P3.21), vesta_IO_buffering (R39.1)
GPIO1_31: Vesta_cape (P3.20), vesta_IO_buffering (R40.1)
SDIO_CLK: Vesta_cape_wifi (R20.1), vesta_IO_buffering (R33.1 U3.15)
SDIO_CMD: Vesta_cape_wifi (R17.1), vesta_IO_buffering (R34.1 U3.14)
SDIO_D0: Vesta_cape_wifi (R22.2), vesta_IO_buffering (R29.1 U3.20)
SDIO_D1: Vesta_cape_wifi (R21.2), vesta_IO_buffering (R30.1 U3.18)
SDIO_D2: Vesta_cape_wifi (R19.2), vesta_IO_buffering (R31.1 U3.17)
SDIO_D3: Vesta_cape_wifi (R18.2), vesta_IO_buffering (R32.1 U3.16)
SLOW_CLK: Vesta_cape_wifi (R3.2 U1.36), Vesta_cape (P4.41), vesta_IO_buffering (U2.16)
UART4_TXD: Vesta_cape (P4.13), vesta_IO_buffering (U2.1)
URAT_4RXD: Vesta_cape (P4.11), vesta_IO_buffering (U2.7)
WL_EN: Vesta_cape_wifi (U1.40), vesta_IO_buffering (R27.2 U2.18)
WL_IRQ: Vesta_cape_wifi (R16.2), vesta_IO_buffering (U2.12)
WL_IRQ_OUT: Vesta_cape (P3.22), vesta_IO_buffering (U2.9)